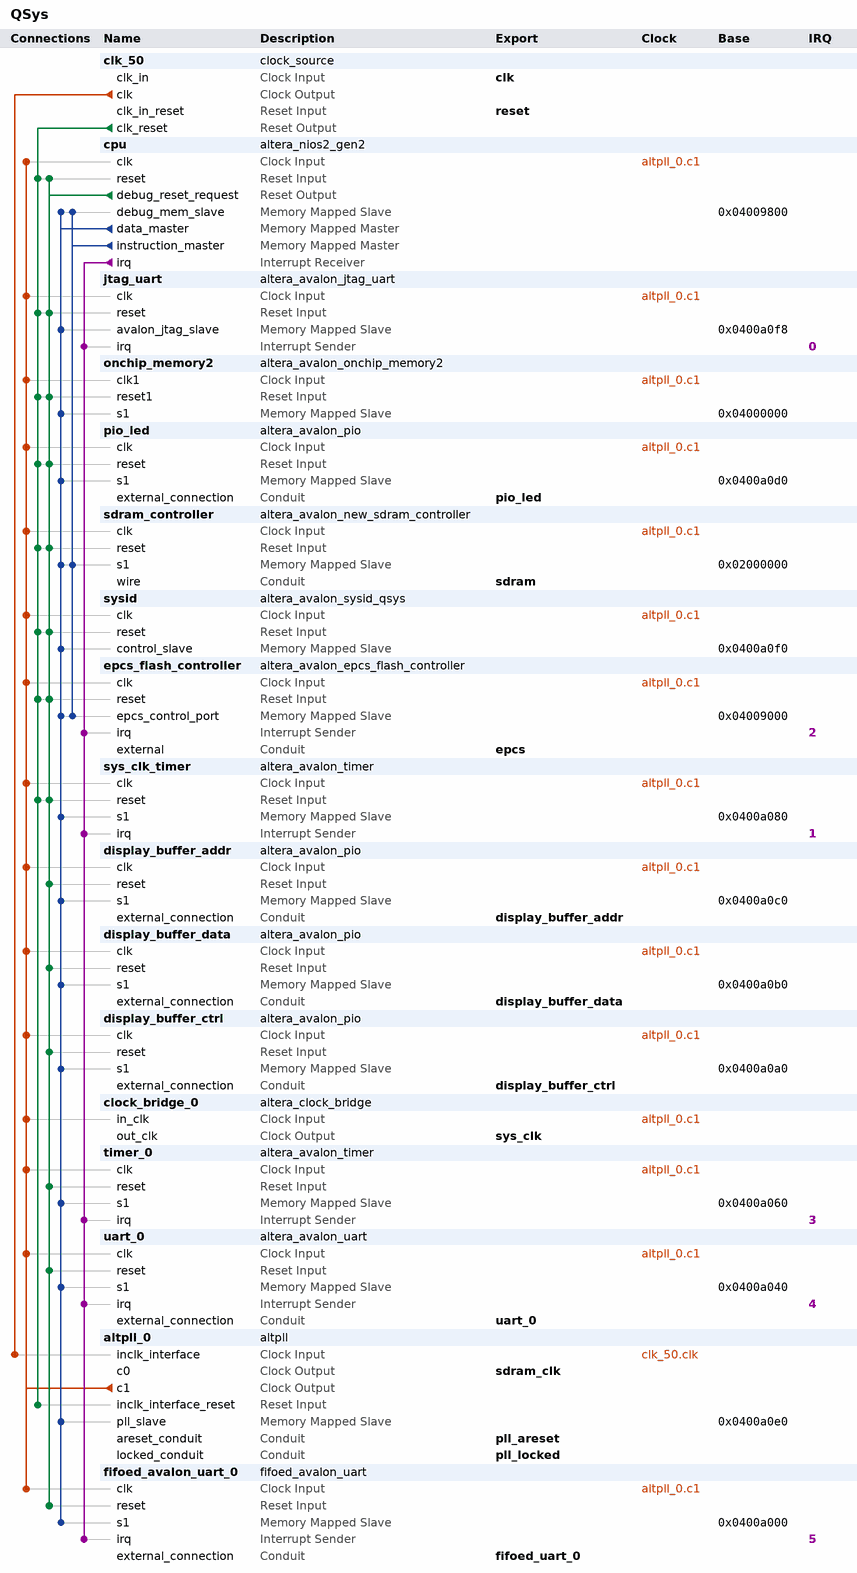
[diagram p0: system contents]
# Platform Designer (Qsys) system QSys, Cyclone IV E EP4CE22F17C6
# Parameters at their usual value, and those the tool derives, are not listed.
package require -exact qsys 17.1
create_system QSys
set_project_property DEVICE_FAMILY {Cyclone IV E}
set_project_property DEVICE EP4CE22F17C6

add_instance clk_50 clock_source 17.1
set_instance_parameter_value clk_50 clockFrequency 50000000

add_instance cpu altera_nios2_gen2 17.1
set_instance_parameter_value cpu dcache_size 2048
set_instance_parameter_value cpu exceptionSlave sdram_controller.s1
set_instance_parameter_value cpu icache_size 4096
set_instance_parameter_value cpu impl Tiny
set_instance_parameter_value cpu resetSlave epcs_flash_controller.epcs_control_port
set_instance_parameter_value cpu setting_activateTrace true

add_instance jtag_uart altera_avalon_jtag_uart 17.1
set_instance_parameter_value jtag_uart simInteractiveOptions NO_INTERACTIVE_WINDOWS

add_instance onchip_memory2 altera_avalon_onchip_memory2 17.1
set_instance_parameter_value onchip_memory2 dataWidth 16
set_instance_parameter_value onchip_memory2 dualPort false
set_instance_parameter_value onchip_memory2 initMemContent true
set_instance_parameter_value onchip_memory2 initializationFileName onchip_mem.hex
set_instance_parameter_value onchip_memory2 memorySize 26000
set_instance_parameter_value onchip_memory2 singleClockOperation true

add_instance pio_led altera_avalon_pio 17.1
set_instance_parameter_value pio_led direction Output
set_instance_parameter_value pio_led width 8

add_instance sdram_controller altera_avalon_new_sdram_controller 17.1
set_instance_parameter_value sdram_controller TAC 6.5
set_instance_parameter_value sdram_controller TRCD 20.0
set_instance_parameter_value sdram_controller TRP 20.0
set_instance_parameter_value sdram_controller casLatency 2
set_instance_parameter_value sdram_controller columnWidth 9
set_instance_parameter_value sdram_controller dataWidth 16
set_instance_parameter_value sdram_controller generateSimulationModel false
set_instance_parameter_value sdram_controller initRefreshCommands 8
set_instance_parameter_value sdram_controller model single_Micron_MT48LC4M32B2_7_chip
set_instance_parameter_value sdram_controller numberOfBanks 4
set_instance_parameter_value sdram_controller numberOfChipSelects 1
set_instance_parameter_value sdram_controller powerUpDelay 200.0
set_instance_parameter_value sdram_controller refreshPeriod 0.75
set_instance_parameter_value sdram_controller rowWidth 13

add_instance sysid altera_avalon_sysid_qsys 17.1
set_instance_parameter_value sysid id 0

add_instance epcs_flash_controller altera_avalon_epcs_flash_controller 17.1
set_instance_parameter_value epcs_flash_controller resetrequest_enabled true

add_instance sys_clk_timer altera_avalon_timer 17.1
set_instance_parameter_value sys_clk_timer period 1
set_instance_parameter_value sys_clk_timer periodUnits MSEC

add_instance display_buffer_addr altera_avalon_pio 17.1
set_instance_parameter_value display_buffer_addr direction Output
set_instance_parameter_value display_buffer_addr width 11

add_instance display_buffer_data altera_avalon_pio 17.1
set_instance_parameter_value display_buffer_data direction Output
set_instance_parameter_value display_buffer_data width 32

add_instance display_buffer_ctrl altera_avalon_pio 17.1
set_instance_parameter_value display_buffer_ctrl direction Output
set_instance_parameter_value display_buffer_ctrl width 8

add_instance clock_bridge_0 altera_clock_bridge 17.1
set_instance_parameter_value clock_bridge_0 DERIVED_CLOCK_RATE 50000000
set_instance_parameter_value clock_bridge_0 EXPLICIT_CLOCK_RATE 0

add_instance timer_0 altera_avalon_timer 17.1
set_instance_parameter_value timer_0 period 1
set_instance_parameter_value timer_0 periodUnits MSEC

add_instance uart_0 altera_avalon_uart 17.1
set_instance_parameter_value uart_0 baud 115200
set_instance_parameter_value uart_0 dataBits 8
set_instance_parameter_value uart_0 fixedBaud false
set_instance_parameter_value uart_0 parity NONE
set_instance_parameter_value uart_0 stopBits 1

add_instance altpll_0 altpll 17.1
set_instance_parameter_value altpll_0 CLK0_DIVIDE_BY 1
set_instance_parameter_value altpll_0 CLK0_MULTIPLY_BY 1
set_instance_parameter_value altpll_0 CLK0_PHASE_SHIFT -3000
set_instance_parameter_value altpll_0 CLK1_DIVIDE_BY 1
set_instance_parameter_value altpll_0 CLK1_DUTY_CYCLE 50
set_instance_parameter_value altpll_0 CLK1_MULTIPLY_BY 1
set_instance_parameter_value altpll_0 CLK1_PHASE_SHIFT 0
set_instance_parameter_value altpll_0 INCLK0_INPUT_FREQUENCY 20000
set_instance_parameter_value altpll_0 PORT_ARESET PORT_USED
set_instance_parameter_value altpll_0 PORT_LOCKED PORT_USED
set_instance_parameter_value altpll_0 PORT_clk1 PORT_USED
set_instance_parameter_value altpll_0 PORT_clk2 PORT_UNUSED
set_instance_parameter_value altpll_0 PORT_clk3 PORT_UNUSED

add_instance fifoed_avalon_uart_0 fifoed_avalon_uart 13.2
set_instance_parameter_value fifoed_avalon_uart_0 add_error_bits false
set_instance_parameter_value fifoed_avalon_uart_0 baud 921600
set_instance_parameter_value fifoed_avalon_uart_0 dataBits 8
set_instance_parameter_value fifoed_avalon_uart_0 driver_pass_error_bits false
set_instance_parameter_value fifoed_avalon_uart_0 export_handshake false
set_instance_parameter_value fifoed_avalon_uart_0 fifo_export_used false
set_instance_parameter_value fifoed_avalon_uart_0 fifo_size_rx 8192
set_instance_parameter_value fifoed_avalon_uart_0 fifo_size_tx 8
set_instance_parameter_value fifoed_avalon_uart_0 fixedBaud true
set_instance_parameter_value fifoed_avalon_uart_0 gap_value 4
set_instance_parameter_value fifoed_avalon_uart_0 hw_cts false
set_instance_parameter_value fifoed_avalon_uart_0 parity NONE
set_instance_parameter_value fifoed_avalon_uart_0 rx_IRQ_Threshold 1
set_instance_parameter_value fifoed_avalon_uart_0 rx_fifo_LE false
set_instance_parameter_value fifoed_avalon_uart_0 simInteractiveInputEnable false
set_instance_parameter_value fifoed_avalon_uart_0 simInteractiveOutputEnable false
set_instance_parameter_value fifoed_avalon_uart_0 simTrueBaud false
set_instance_parameter_value fifoed_avalon_uart_0 stopBits 1
set_instance_parameter_value fifoed_avalon_uart_0 syncRegDepth 2
set_instance_parameter_value fifoed_avalon_uart_0 timeout_value 4
set_instance_parameter_value fifoed_avalon_uart_0 timestamp_width 8
set_instance_parameter_value fifoed_avalon_uart_0 trans_pin false
set_instance_parameter_value fifoed_avalon_uart_0 tx_IRQ_Threshold 4
set_instance_parameter_value fifoed_avalon_uart_0 tx_fifo_LE false
set_instance_parameter_value fifoed_avalon_uart_0 useCtsRts false
set_instance_parameter_value fifoed_avalon_uart_0 useEopRegister false
set_instance_parameter_value fifoed_avalon_uart_0 useRelativePathForSimFile false
set_instance_parameter_value fifoed_avalon_uart_0 use_ext_timestamp false
set_instance_parameter_value fifoed_avalon_uart_0 use_gap_detection true
set_instance_parameter_value fifoed_avalon_uart_0 use_rx_fifo true
set_instance_parameter_value fifoed_avalon_uart_0 use_status_bit_clear false
set_instance_parameter_value fifoed_avalon_uart_0 use_timestamp false
set_instance_parameter_value fifoed_avalon_uart_0 use_timout false
set_instance_parameter_value fifoed_avalon_uart_0 use_tx_fifo true

# connections
add_connection altpll_0.c1 clock_bridge_0.in_clk clock
add_connection altpll_0.c1 cpu.clk clock
add_connection altpll_0.c1 display_buffer_addr.clk clock
add_connection altpll_0.c1 display_buffer_ctrl.clk clock
add_connection altpll_0.c1 display_buffer_data.clk clock
add_connection altpll_0.c1 epcs_flash_controller.clk clock
add_connection altpll_0.c1 fifoed_avalon_uart_0.clk clock
add_connection altpll_0.c1 jtag_uart.clk clock
add_connection altpll_0.c1 onchip_memory2.clk1 clock
add_connection altpll_0.c1 pio_led.clk clock
add_connection altpll_0.c1 sdram_controller.clk clock
add_connection altpll_0.c1 sys_clk_timer.clk clock
add_connection altpll_0.c1 sysid.clk clock
add_connection altpll_0.c1 timer_0.clk clock
add_connection altpll_0.c1 uart_0.clk clock
add_connection clk_50.clk altpll_0.inclk_interface clock
add_connection clk_50.clk_reset altpll_0.inclk_interface_reset reset
add_connection clk_50.clk_reset cpu.reset reset
add_connection clk_50.clk_reset epcs_flash_controller.reset reset
add_connection clk_50.clk_reset jtag_uart.reset reset
add_connection clk_50.clk_reset onchip_memory2.reset1 reset
add_connection clk_50.clk_reset pio_led.reset reset
add_connection clk_50.clk_reset sdram_controller.reset reset
add_connection clk_50.clk_reset sys_clk_timer.reset reset
add_connection clk_50.clk_reset sysid.reset reset
add_connection cpu.debug_reset_request cpu.reset reset
add_connection cpu.debug_reset_request display_buffer_addr.reset reset
add_connection cpu.debug_reset_request display_buffer_ctrl.reset reset
add_connection cpu.debug_reset_request display_buffer_data.reset reset
add_connection cpu.debug_reset_request epcs_flash_controller.reset reset
add_connection cpu.debug_reset_request fifoed_avalon_uart_0.reset reset
add_connection cpu.debug_reset_request jtag_uart.reset reset
add_connection cpu.debug_reset_request onchip_memory2.reset1 reset
add_connection cpu.debug_reset_request pio_led.reset reset
add_connection cpu.debug_reset_request sdram_controller.reset reset
add_connection cpu.debug_reset_request sys_clk_timer.reset reset
add_connection cpu.debug_reset_request sysid.reset reset
add_connection cpu.debug_reset_request timer_0.reset reset
add_connection cpu.debug_reset_request uart_0.reset reset
add_connection cpu.data_master altpll_0.pll_slave avalon
set_connection_parameter_value cpu.data_master/altpll_0.pll_slave baseAddress 0x0400a0e0
add_connection cpu.data_master cpu.debug_mem_slave avalon
set_connection_parameter_value cpu.data_master/cpu.debug_mem_slave baseAddress 0x04009800
add_connection cpu.data_master display_buffer_addr.s1 avalon
set_connection_parameter_value cpu.data_master/display_buffer_addr.s1 baseAddress 0x0400a0c0
add_connection cpu.data_master display_buffer_ctrl.s1 avalon
set_connection_parameter_value cpu.data_master/display_buffer_ctrl.s1 baseAddress 0x0400a0a0
add_connection cpu.data_master display_buffer_data.s1 avalon
set_connection_parameter_value cpu.data_master/display_buffer_data.s1 baseAddress 0x0400a0b0
add_connection cpu.data_master epcs_flash_controller.epcs_control_port avalon
set_connection_parameter_value cpu.data_master/epcs_flash_controller.epcs_control_port baseAddress 0x04009000
add_connection cpu.data_master fifoed_avalon_uart_0.s1 avalon
set_connection_parameter_value cpu.data_master/fifoed_avalon_uart_0.s1 baseAddress 0x0400a000
add_connection cpu.data_master jtag_uart.avalon_jtag_slave avalon
set_connection_parameter_value cpu.data_master/jtag_uart.avalon_jtag_slave baseAddress 0x0400a0f8
add_connection cpu.data_master onchip_memory2.s1 avalon
set_connection_parameter_value cpu.data_master/onchip_memory2.s1 baseAddress 0x04000000
add_connection cpu.data_master pio_led.s1 avalon
set_connection_parameter_value cpu.data_master/pio_led.s1 baseAddress 0x0400a0d0
add_connection cpu.data_master sdram_controller.s1 avalon
set_connection_parameter_value cpu.data_master/sdram_controller.s1 baseAddress 0x02000000
add_connection cpu.data_master sys_clk_timer.s1 avalon
set_connection_parameter_value cpu.data_master/sys_clk_timer.s1 baseAddress 0x0400a080
add_connection cpu.data_master sysid.control_slave avalon
set_connection_parameter_value cpu.data_master/sysid.control_slave baseAddress 0x0400a0f0
add_connection cpu.data_master timer_0.s1 avalon
set_connection_parameter_value cpu.data_master/timer_0.s1 baseAddress 0x0400a060
add_connection cpu.data_master uart_0.s1 avalon
set_connection_parameter_value cpu.data_master/uart_0.s1 baseAddress 0x0400a040
add_connection cpu.instruction_master cpu.debug_mem_slave avalon
set_connection_parameter_value cpu.instruction_master/cpu.debug_mem_slave baseAddress 0x04009800
add_connection cpu.instruction_master epcs_flash_controller.epcs_control_port avalon
set_connection_parameter_value cpu.instruction_master/epcs_flash_controller.epcs_control_port baseAddress 0x04009000
add_connection cpu.instruction_master sdram_controller.s1 avalon
set_connection_parameter_value cpu.instruction_master/sdram_controller.s1 baseAddress 0x02000000
add_connection cpu.irq epcs_flash_controller.irq interrupt
set_connection_parameter_value cpu.irq/epcs_flash_controller.irq irqNumber 2
add_connection cpu.irq fifoed_avalon_uart_0.irq interrupt
set_connection_parameter_value cpu.irq/fifoed_avalon_uart_0.irq irqNumber 5
add_connection cpu.irq jtag_uart.irq interrupt
set_connection_parameter_value cpu.irq/jtag_uart.irq irqNumber 0
add_connection cpu.irq sys_clk_timer.irq interrupt
set_connection_parameter_value cpu.irq/sys_clk_timer.irq irqNumber 1
add_connection cpu.irq timer_0.irq interrupt
set_connection_parameter_value cpu.irq/timer_0.irq irqNumber 3
add_connection cpu.irq uart_0.irq interrupt
set_connection_parameter_value cpu.irq/uart_0.irq irqNumber 4

# exported interfaces
add_interface clk clock sink
set_interface_property clk EXPORT_OF clk_50.clk_in
add_interface display_buffer_addr conduit end
set_interface_property display_buffer_addr EXPORT_OF display_buffer_addr.external_connection
add_interface display_buffer_ctrl conduit end
set_interface_property display_buffer_ctrl EXPORT_OF display_buffer_ctrl.external_connection
add_interface display_buffer_data conduit end
set_interface_property display_buffer_data EXPORT_OF display_buffer_data.external_connection
add_interface epcs conduit end
set_interface_property epcs EXPORT_OF epcs_flash_controller.external
add_interface fifoed_uart_0 conduit end
set_interface_property fifoed_uart_0 EXPORT_OF fifoed_avalon_uart_0.external_connection
add_interface pio_led conduit end
set_interface_property pio_led EXPORT_OF pio_led.external_connection
add_interface pll_areset conduit end
set_interface_property pll_areset EXPORT_OF altpll_0.areset_conduit
add_interface pll_locked conduit end
set_interface_property pll_locked EXPORT_OF altpll_0.locked_conduit
add_interface reset reset sink
set_interface_property reset EXPORT_OF clk_50.clk_in_reset
add_interface sdram conduit end
set_interface_property sdram EXPORT_OF sdram_controller.wire
add_interface sdram_clk clock source
set_interface_property sdram_clk EXPORT_OF altpll_0.c0
add_interface sys_clk clock source
set_interface_property sys_clk EXPORT_OF clock_bridge_0.out_clk
add_interface uart_0 conduit end
set_interface_property uart_0 EXPORT_OF uart_0.external_connection

set_interconnect_requirement {$system} qsys_mm.clockCrossingAdapter HANDSHAKE
set_interconnect_requirement {$system} qsys_mm.insertDefaultSlave FALSE
set_interconnect_requirement {$system} qsys_mm.maxAdditionalLatency 1

save_system QSys.qsys
